# Altium schematic sheet main.SchDoc
size A; SheetNumber: 1; SheetTotal: 1
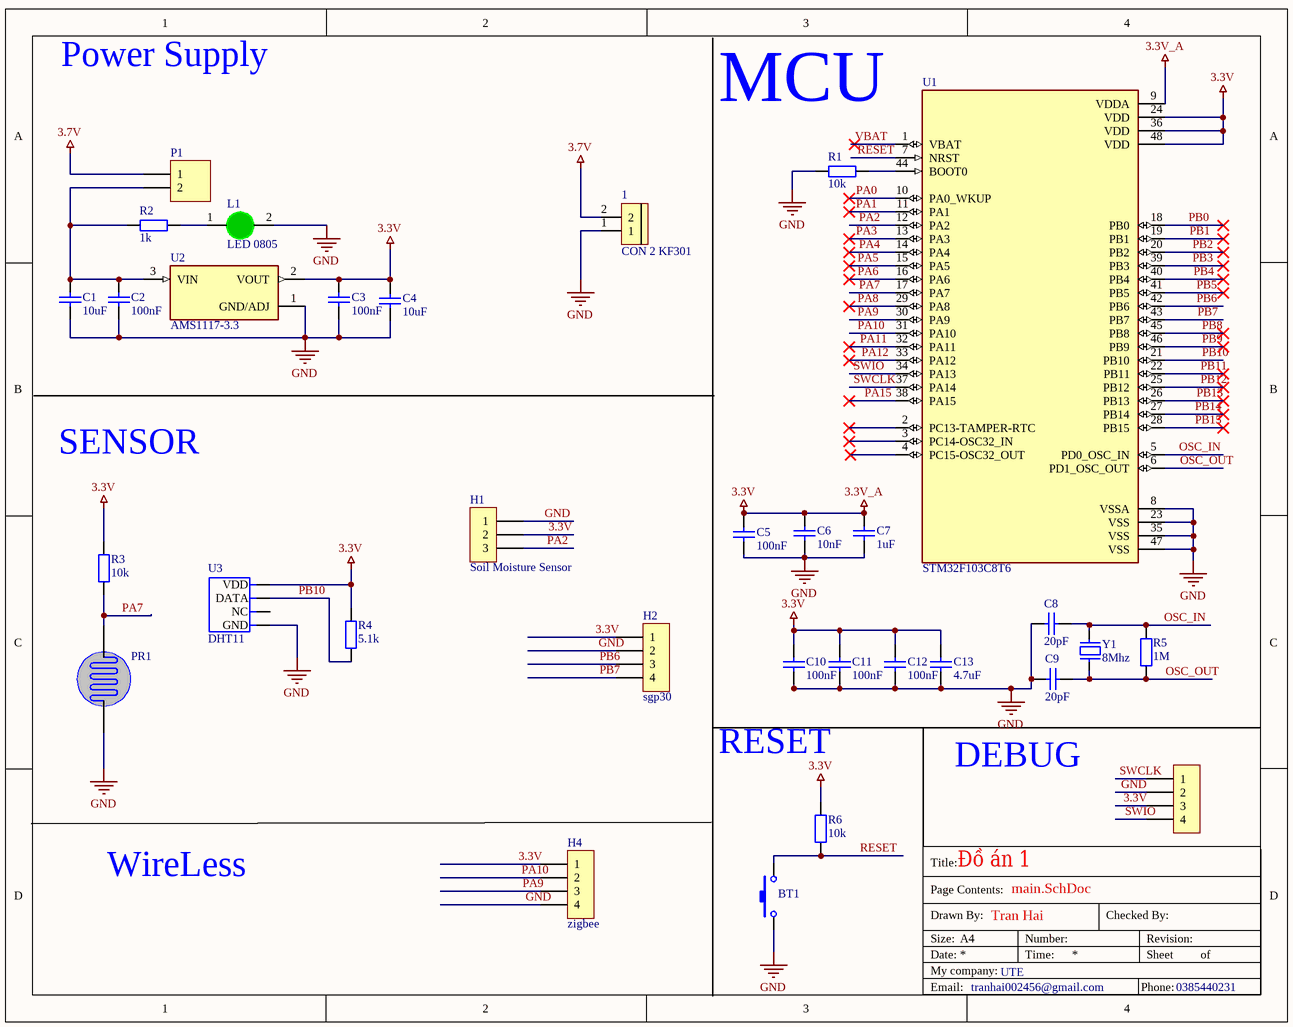
[diagram p0: main.SchDoc]

## Parts
1  CON 2 KF301  [Con 2 KF301 5.08]
BT1  Nut Nhan 2 Chan SMD 3x6x2.5  [Nut Nhan 2 Chan SMD 3x6x2.5]  (value not drawn)
C1  10uF  [Tu 0805]
C2  100nF  [Tu 0805]
C3  100nF  [Tu 0805]
C4  10uF  [Tu 0805]
C5  100nF  [tu 0805]
C6  10nF  [tu 0805]
C7  1uF  [tu 0805]
C8  20pF  [tu 0805]
C9  20pF  [tu 0805]
C10  100nF  [tu 0805]
C11  100nF  [tu 0805]
C12  100nF  [tu 0805]
C13  4.7uF  [tu 0805]
H1  Soil Moisture Sensor  [XH2.54M-3]
H2  sgp30  [XH2.54M-4]
H3  Header 4P 2.54 Duc Thang  [XH2.54M-4]  (value not drawn)
H4  zigbee  [XH2.54M-4]
L1  LED 0805  [LED-0805-Green]
P1  Header 2  [HDR1X2]  (value not drawn)
PR1  Quang Tro  [Quang Tro]  (value not drawn)
R1  10k  [tro smd 0805]
R2  1k  [tro smd 0805]
R3  10k  [tro smd 0805]
R4  5.1k  [tro smd 0805]
R5  1M  [tro smd 0805]
R6  10k  [tro smd 0805]
U1  STM32F103C8T6  [QFP50P900X900X160-48N]
U2  AMS1117-3.3  [SOT229P700X180-4N]
U3  DHT11  [SNR4-2.54-15.5X12.0X5.5MM]
Y1  8Mhz  [Thach Anh 2 chan cam]

## Nets
3.3V: C3.1 C4.1 C5.1 C6.1 C7.1 C10.1 C11.1 C12.1 C13.1 H1.2 H2.1 H3.3 H4.1 R3.2 R4.2 R6.2 U1.9(VDDA) U1.24(VDD) U1.36(VDD) U1.48(VDD) U2.2(VOUT) U3.1(VDD)  [also labelled 3.3V_A]
3.7V: 1.2 P1.1
GND: 1.1 BT1.1 C1.2 C2.2 C3.2 C4.2 C5.2 C6.2 C7.2 C8.2 C9.2 C10.2 C11.2 C12.2 C13.2 H1.1 H2.2 H3.2 H4.4 L1.2(K) PR1.2 R1.1 U1.8(VSSA) U1.23(VSS) U1.35(VSS) U1.47(VSS) U2.1(GND/ADJ) U3.4(GND)
OSC_IN: C8.1 R5.2 U1.5(PD0_OSC_IN) Y1.2
OSC_OUT: C9.1 R5.1 U1.6(PD1_OSC_OUT) Y1.1
PA0: U1.10(PA0_WKUP)
PA1: U1.11(PA1)
PA2: H1.3 U1.12(PA2)
PA3: U1.13(PA3)
PA4: U1.14(PA4)
PA5: U1.15(PA5)
PA6: U1.16(PA6)
PA7: PR1.1 R3.1 U1.17(PA7)
PA8: U1.29(PA8)
PA9: H4.3 U1.30(PA9)
PA10: H4.2 U1.31(PA10)
PA11: U1.32(PA11)
PA12: U1.33(PA12)
PA15: U1.38(PA15)
PB0: U1.18(PB0)
PB1: U1.19(PB1)
PB2: U1.20(PB2)
PB3: U1.39(PB3)
PB4: U1.40(PB4)
PB5: U1.41(PB5)
PB6: H2.3 U1.42(PB6)
PB7: H2.4 U1.43(PB7)
PB8: U1.45(PB8)
PB9: U1.46(PB9)
PB10: R4.1 U1.21(PB10) U3.2(DATA)
PB11: U1.22(PB11)
PB12: U1.25(PB12)
PB13: U1.26(PB13)
PB14: U1.27(PB14)
PB15: U1.28(PB15)
RESET: BT1.2 R6.1 U1.7(NRST)
SWCLK: H3.1 U1.37(PA14)
SWIO: H3.4 U1.34(PA13)
VBAT: U1.1(VBAT)
NetC1_1: C1.1 C2.1 P1.2 R2.1 U2.3(VIN)
NetL1_1: L1.1(A) R2.2
NetR1_2: R1.2 U1.44(BOOT0)

Not connected (* = marked no-connect by the designer): U1 2(PC13-TAMPER-RTC)* 3(PC14-OSC32_IN)* 4(PC15-OSC32_OUT)*; U3 3(NC)

## Notes on the sheet
- Power Supply
- (near R1) MCU
- SENSOR
- RESET
- DEBUG
- WireLess
- Đồ án 1
- Title:
- Page Contents:
- Size:
- Date:
- Drawn By:
- My company:
- Email:
- A4
- tranhai002456@gmail.com
- Tran Hai
- UTE
- Number:
- Time:
- Checked By:
- Phone:
- Revision:
- Sheet
- 0385440231
- of

## Library data of the parts
1 = CON 2 KF301: Cắm; Ma_Hang: MH000987; Ten_Linh_Kien: CON 2 KF301-2P 5.08MM Xanh Dương; Chung_Loai: Cắm; Ghi_Chu: *; Kieu_Chan: *; Don_Vi: Con
BT1 = Nut Nhan 2 Chan SMD 3x6x2.5: Ma_Hang: MH001036; Ten: Nút Nhấn 2 Chân 3x6x2.5MM SMD
C1-C4 = Tu 0805 200pF 50V 10%: Dán; Ten_Linh_Kien: Tụ 0805 200p 10% 50V; Don_Vi: Con; So_Chan: 2; Ma_Hang: MH008100; Chung_Loai: Dán; Kieu_Chan: *
C5-C13 = Tu 0805 101 50V 20%: Dán; Don_Vi: Con; So_Chan: 2; Ten_Linh_Kien: Tụ 0805 101-0.1nF 50V 20%; Ma_Hang: MH002806; Chung_Loai: Dán; Kieu_Chan: *
H1 = Header 3P 2.54 Duc Thang: Cắm; Ten_Linh_Kien: Header 3P XH2.54-3P Đực Thẳng; Don_Vi: Con; Ma_Hang: MH001292; Chung_Loai: Cắm
H2-H4 = Header 4P 2.54 Duc Thang: Cắm; Ten_Linh_Kien: Header 4P XH2.54-4P Đực Thẳng; Don_Vi: Con; Ma_Hang: MH001285; Chung_Loai: Cắm
L1 = LED 0805 Xanh La: Dán; Don_Vi: Con; Ma_Hang: MH002326; Ten_Linh_Kien: LED 0805 Màu Xanh Lá (Green); Ghi_Chu: *; Kieu_Chan: *; Chung_Loai: Dán
P1 = Header 2: Header, 2-Pin; LatestRevisionDate: 17-Jul-2002; LatestRevisionNote: Re-released for DXP Platform.; Publisher: Altium Limited
PR1 = Quang Tro: Photoresistor; Creator: Bien Nguyen
R1-R6 = Tro 0805 1% 10k: Dán; Don_Vi: Con; So_Chan: 2; Ten_Linh_Kien: Trở 0805 1% 10k; Ma_Hang: MH005473; Chung_Loai: Dán; Kieu_Chan: *
U1 = STM32F103C8T6: ARM® Cortex®-M3 STM32F1 Microcontroller IC 32-Bit 72MHz 64KB (64K x 8) FLASH 48-LQFP (7x7); MF: STMicroelectronics; SnapEDA_Link: https://www.snapeda.com/parts/STM32F103C8T6/STMicroelectronics/view-part/?ref=snap; Package: LQFP-48 STMicroelectronics; Value: *; MP: STM32F103C8T6; Check_prices: https://www.snapeda.com/parts/STM32F103C8T6/STMicroelectronics/view-part/?ref=eda
U2 = AMS1117-3.3: Sot223/Pkg 1-Amp 3.3-Volt Low Drop Out Voltage Regulatator; MF: Advanced Monolithic Systems; Package: SOT-223 Seeed Technology; Value: *; Check_prices: https://www.snapeda.com/parts/AMS1117-3.3/Advanced+Monolithic+Systems/view-part/?ref=eda; Price: None; Availability: Not in stock; MP: AMS1117-3.3; SnapEDA_Link: https://www.snapeda.com/parts/AMS1117-3.3/Advanced+Monolithic+Systems/view-part/?ref=snap
U3 = TEM-HUM-DHT11(4P-15.5X12.0MM): Äá»™ áº©m, nhiá»‡t Ä‘á»™ Ká»¹ thuáº­t sá»‘ Â±5% RH qua lá»—; MF: UNIVERSAL-SOLDER Electronics Ltd; SnapEDA_Link: https://www.snapeda.com/parts/DHT11/UNIVERSAL-SOLDER+Electronics+Ltd/view-part/?ref=snap; Package: None; Value: *; MP: DHT11; Check_prices: https://www.snapeda.com/parts/DHT11/UNIVERSAL-SOLDER+Electronics+Ltd/view-part/?ref=eda
Y1 = Thach Anh 2 chan Cam: Crystal For all Crystal 2pin.; Value: 4Mhz